# Altium schematic sheet Vumetre_Lecteur.SchDoc
size A4
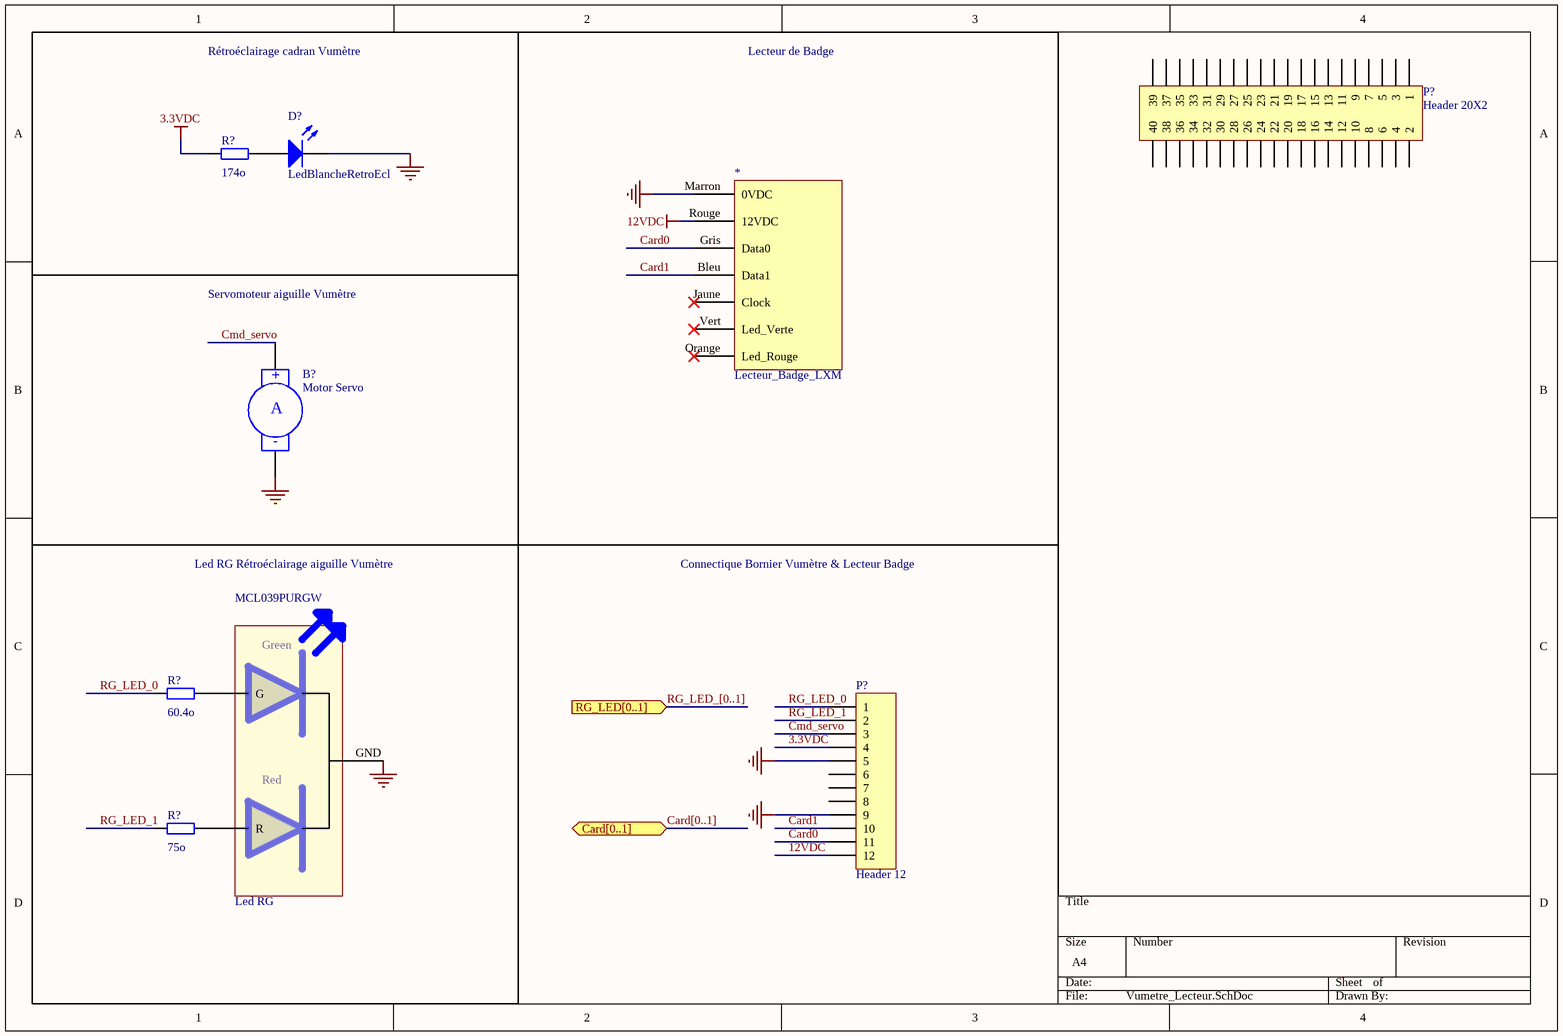
[diagram p0: Vumetre_Lecteur.SchDoc]

## Parts
(Parts that share a designator on the sheet are numbered #1, #2 ... from top to bottom, then left to right.)
*  Lecteur_Badge_LXM
B?  Motor Servo  [RAD-0.4]
D?  LedBlancheRetroEcl  [LED-0]
MCL039PURGW  Led RG
P?#1  Header 20X2  [HDR2X20]
P?#2  Header 12  [HDR1X12]
R?#1  value 174o  [AXIAL-0.4]  (hidden comment: Res2)
R?#2  value 60.4o  [AXIAL-0.4]  (hidden comment: Res2)
R?#3  value 75o  [AXIAL-0.4]  (hidden comment: Res2)

## Ports
Card[0..1], RG_LED[0..1] (in)

## Nets
3.3VDC: P?#2.4 R?#1.1
12VDC: *.Rouge(12VDC) P?#2.12
GND: *.Marron(0VDC) B?.2(-) D?.2(K) MCL039PURGW.GND P?#2.5 P?#2.9
Card0: *.Gris(Data0) P?#2.11
Card1: *.Bleu(Data1) P?#2.10
Cmd_servo: B?.1(+) P?#2.3
RG_LED_0: P?#2.1 R?#2.1
RG_LED_1: P?#2.2 R?#3.1
NetD?_1: D?.1(A) R?#1.2
NetMCL039PURGW_G: MCL039PURGW.G R?#2.2
NetMCL039PURGW_R: MCL039PURGW.R R?#3.2

Not connected (* = marked no-connect by the designer): * Jaune(Clock)* Orange(Led_Rouge)* Vert(Led_Verte)*; P?#1 1 2 3 4 5 6 7 8 9 10 11 12 13 14 15 16 17 18 19 20 21 22 23 24 25 26 27 28 29 30 31 32 33 34 35 36 37 38 39 40; P?#2 6 7 8

## Buses and harness runs
bus Card[0..1] = port Card[0..1]
bus RG_LED_[0..1] = port RG_LED[0..1]

## Notes on the sheet
- Rétroéclairage cadran Vumètre
- Lecteur de Badge
- Servomoteur aiguille Vumètre
- Led RG Rétroéclairage aiguille Vumètre
- Connectique Bornier Vumètre & Lecteur Badge
- (in symbol MCL039PURGW) Green; Red
- (in symbol Motor Servo) A

## Library data of the parts
* = Lecteur_Badge_LXM: Fournisseur: Gregoire; Fabricant: Stid-Security; Ref.Fournisseur: :); Ref.Fabricant: LXM_WIEGAND44b
B? = Motor Servo: Servo Motor; Published: 24-Mar-1999; LatestRevisionDate: 17-Jul-2002; LatestRevisionNote: Re-released for DXP Platform.; PackageReference: RAD-0.4; Publisher: Altium Limited; PackageDescription: Radial Cap, Thru-Hole; 2 Leads; 0.4 in Pin Spacing
D? = LED0: LED Blanche retro vumetre; Fournisseur: Farnell; Fabricant: Multicomp; Ref.Fabricant: MCL034SWC-WH1; Ref.Fournisseur: 1581176
MCL039PURGW = MCL039PURGW: Fournisseur: Farnell; Fabricant: Multicomp; Ref.Fournisseur: 1581194; Ref.Fabricant: MCL039PURGW
P?#1 = Header 20X2: Header, 20-Pin, Dual row; LatestRevisionDate: 17-Jul-2002; LatestRevisionNote: Re-released for DXP Platform.; Publisher: Altium Limited
P?#2 = Header 12: Header, 12-Pin; LatestRevisionDate: 17-Jul-2002; LatestRevisionNote: Re-released for DXP Platform.; Publisher: Altium Limited
R?#1 = Res2: Resistor; Fournisseur: Farnell; Fabricant: PANASONIC; Ref.Fabricant: ERJ2RKF1740X; Ref.Fournisseur: 2302553
R?#2 R?#3 = Res2: Resistor; Fournisseur: Farnell; Fabricant: TE CONNECTIVITY; Ref.Fabricant: CPF0805B75RE1; Ref.Fournisseur: 1697415